# EAGLE design analog3 (EAGLE 6.5.0)
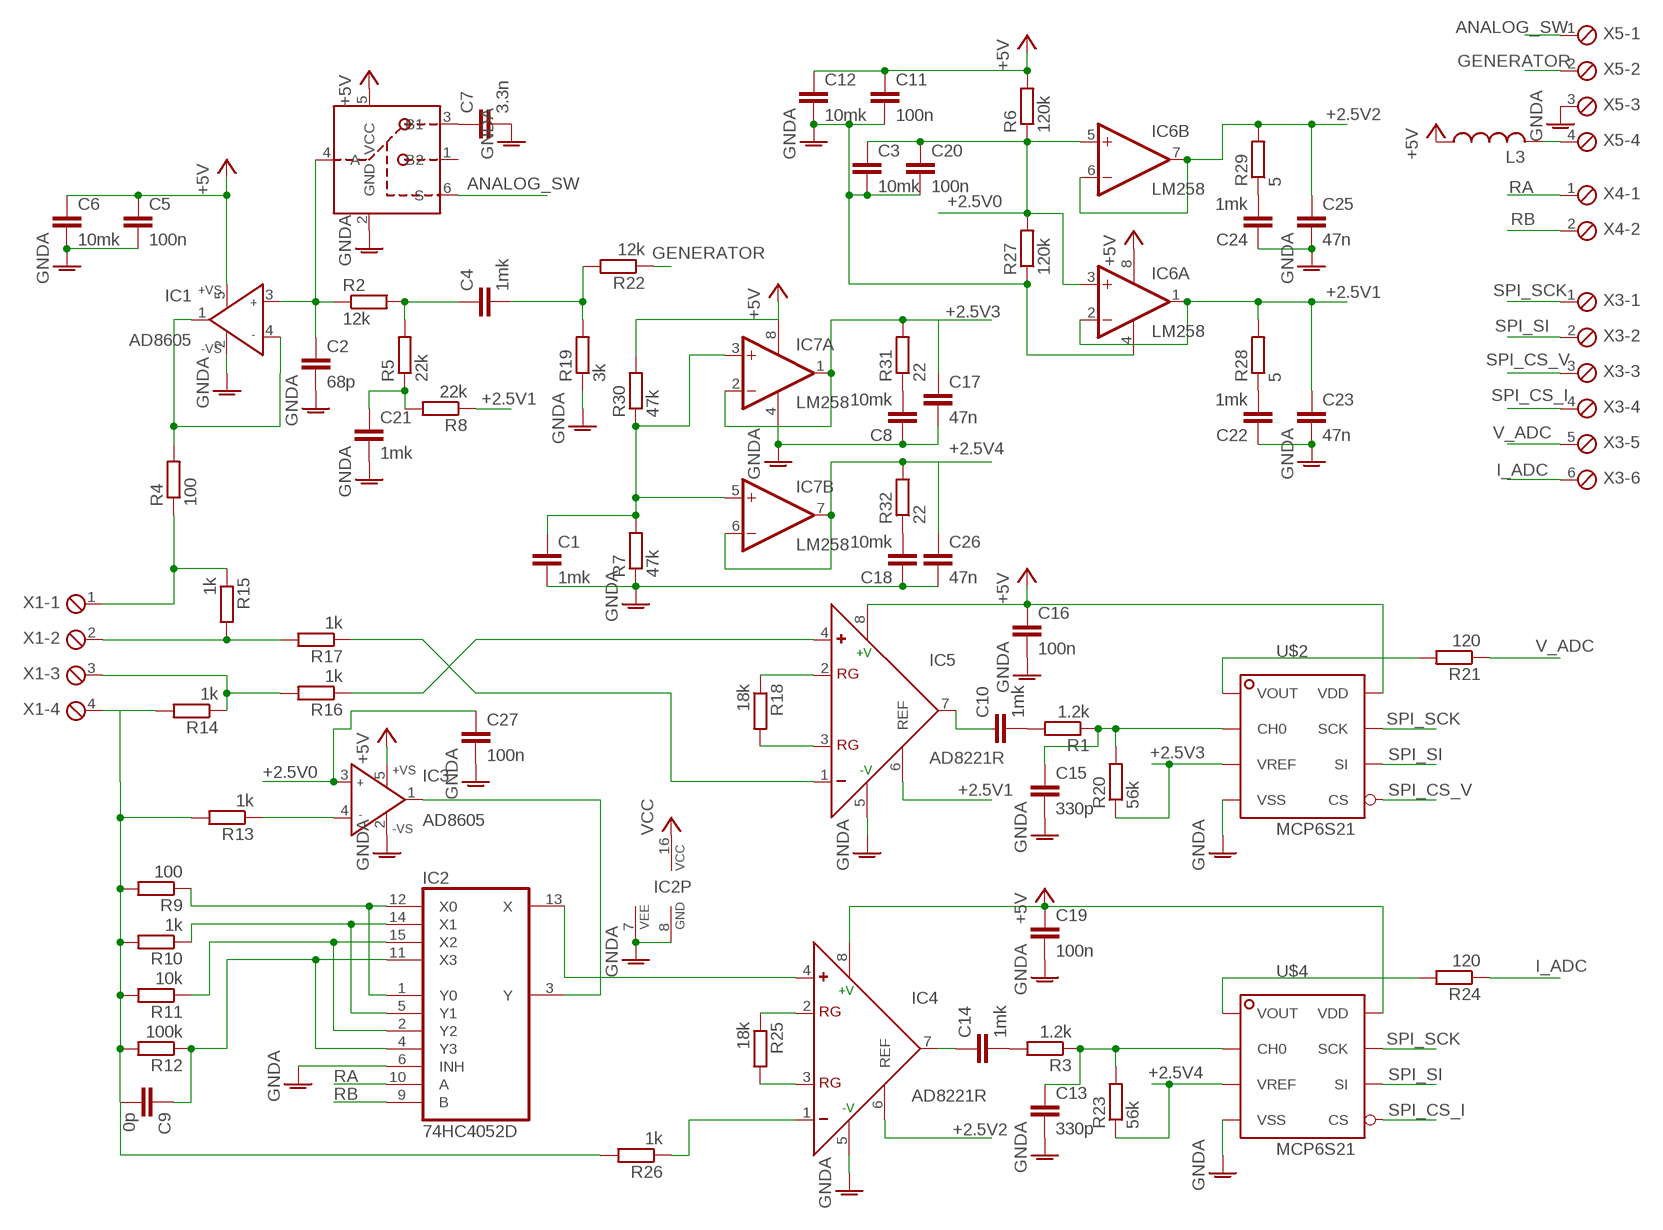
[diagram p0: schematic, sheet 1]

## Parts
C1  1mk  C-EUC0603  [C0603]
C2  68p  C-EUC0805  [C0805]
C3  10mk  C-EUC0805  [C0805]
C4  1mk  C-EUC0603  [C0603]
C5  100n  C-EUC0603  [C0603]
C6  10mk  C-EUC0805  [C0805]
C7  3.3n  C-EUC0805  [C0805]
C8  10mk  C-EUC0805  [C0805]
C9  0p  C-EUC0805  [C0805]
C10  1mk  C-EUC0603  [C0603]
C11  100n  C-EUC0603  [C0603]
C12  10mk  C-EUC0805  [C0805]
C13  330p  C-EUC0805  [C0805]
C14  1mk  C-EUC0603  [C0603]
C15  330p  C-EUC0805  [C0805]
C16  100n  C-EUC0603  [C0603]
C17  47n  C-EUC0805  [C0805]
C18  10mk  C-EUC0805  [C0805]
C19  100n  C-EUC0603  [C0603]
C20  100n  C-EUC0603  [C0603]
C21  1mk  C-EUC0603  [C0603]
C22  1mk  C-EUC0603  [C0603]
C23  47n  C-EUC0805  [C0805]
C24  1mk  C-EUC0603  [C0603]
C25  47n  C-EUC0805  [C0805]
C26  47n  C-EUC0805  [C0805]
C27  100n  C-EUC0603  [C0603]
IC1  AD8605  AD8603UJ  [SOT23-5]
IC2  74HC4052D  4052D  [SO16]
IC3  AD8605  AD8603UJ  [SOT23-5]
IC4  AD8221R  [SO8]
IC5  AD8221R  [SO8]
IC6  LM258  LM358D  [SO08]
IC7  LM258  LM358D  [SO08]
L3  L-US0204/7  [0204/7]
R1  1.2k  R-EU_R0603  [R0603]
R2  12k  R-EU_R0603  [R0603]
R3  1.2k  R-EU_R0603  [R0603]
R4  100  R-EU_R0603  [R0603]
R5  22k  R-EU_R0603  [R0603]
R6  120k  R-EU_R0603  [R0603]
R7  47k  R-EU_R0603  [R0603]
R8  22k  R-EU_R0603  [R0603]
R9  100  R-EU_R0603  [R0603]
R10  1k  R-EU_R0603  [R0603]
R11  10k  R-EU_R0603  [R0603]
R12  100k  R-EU_R0603  [R0603]
R13  1k  R-EU_R0603  [R0603]
R14  1k  R-EU_R0603  [R0603]
R15  1k  R-EU_R0603  [R0603]
R16  1k  R-EU_R0603  [R0603]
R17  1k  R-EU_R0603  [R0603]
R18  18k  R-EU_R0603  [R0603]
R19  3k  R-EU_R0603  [R0603]
R20  56k  R-EU_R0603  [R0603]
R21  120  R-EU_R0603  [R0603]
R22  12k  R-EU_R0603  [R0603]
R23  56k  R-EU_R0603  [R0603]
R24  120  R-EU_R0603  [R0603]
R25  18k  R-EU_R0603  [R0603]
R26  1k  R-EU_R0603  [R0603]
R27  120k  R-EU_R0603  [R0603]
R28  5  R-EU_R0805  [R0805]
R29  5  R-EU_R0805  [R0805]
R30  47k  R-EU_R0603  [R0603]
R31  22  R-EU_R0805  [R0805]
R32  22  R-EU_R0805  [R0805]
U$1  SN74LVC1G3157DBVR  [SOT23-6]
U$2  MCP6S21  [SO8]
U$4  MCP6S21  [SO8]
X1  MPT4  [4POL254]
X3  MPT6  [6POL254]
X4  MPT2  [2POL254]
X5  MPT4  [4POL254]

## Nets
+2.5V0: C3.1 C20.1 C27.1 IC3.3(IN+) IC6.3(A:+IN) IC6.5(B:+IN) R6.1 R27.2
+2.5V1: C23.1 IC5.6(REF) IC6.1(A:OUT) IC6.2(A:-IN) R8.1 R28.2
+2.5V2: C25.1 IC4.6(REF) IC6.6(B:-IN) IC6.7(B:OUT) R29.2
+2.5V3: C17.1 IC7.1(A:OUT) IC7.2(A:-IN) R20.1 R31.2 U$2.3(VREF)
+2.5V4: C26.1 IC7.6(B:-IN) IC7.7(B:OUT) R23.1 R32.2 U$4.3(VREF)
+5V: C5.1 C6.1 C11.1 C12.1 C16.1 C19.1 IC1.5(+VS) IC3.5(+VS) IC4.8(+V) IC5.8(+V) IC6.8(P:V+) IC7.8(P:V+) L3.1 R6.2 R30.2 U$1.5(VCC) U$2.8(VDD) U$4.8(VDD)
ANALOG_SW: U$1.6(S) X5.1
GENERATOR: R22.1 X5.2
GNDA: C1.2 C2.2 C3.2 C5.2 C6.2 C7.2 C8.1 C11.2 C12.2 C13.2 C15.2 C16.2 C17.2 C18.1 C19.2 C20.2 C21.2 C22.1 C23.2 C24.1 C25.2 C26.2 C27.2 IC1.2(-VS) IC2.6(INH) IC2.7(VEE) IC2.8(GND) IC3.2(-VS) IC4.5(-V) IC5.5(-V) IC6.4(P:V-) IC7.4(P:V-) R7.1 R19.1 R27.1 U$1.2(GND) U$2.4(VSS) U$4.4(VSS) X5.3
I_ADC: R24.1 X3.6
N$1: IC5.1(-) R17.1
N$3: C2.1 IC1.3(IN+) R2.1 U$1.4(A)
N$4: C4.1 R2.2 R5.2
N$5: IC1.1(OUT) IC1.4(IN-) R4.2
N$6: L3.2 X5.4
N$7: C7.1 U$1.3(B1)
N$8: IC3.4(IN-) R13.1
N$9: IC4.3(RG) R25.2
N$10: C21.1 R5.1 R8.2
N$11: IC2.3(Y) IC3.1(OUT)
N$12: IC2.1(Y0) IC2.12(X0) R9.1
N$13: IC2.5(Y1) IC2.14(X1) R10.1
N$14: IC2.2(Y2) IC2.15(X2) R11.1
N$15: C9.1 IC2.4(Y3) IC2.11(X3) R12.1
N$16: R14.1 R16.2 X1.3
N$17: R15.2 R17.2 X1.2
N$18: C9.2 R9.2 R10.2 R11.2 R12.2 R13.2 R14.2 R26.2 X1.4
N$19: R4.1 R15.1 X1.1
N$20: C10.1 IC5.7(OUT)
N$21: IC4.2(RG) R25.1
N$22: IC4.1(-) R26.1
N$23: IC5.3(RG) R18.2
N$24: IC5.2(RG) R18.1
N$25: C13.1 R3.1 R23.2 U$4.2(CH0)
N$26: R24.2 U$4.1(VOUT)
N$27: C15.1 R1.1 R20.2 U$2.2(CH0)
N$28: R21.2 U$2.1(VOUT)
N$29: C14.1 IC4.7(OUT)
N$30: IC2.13(X) IC4.4(+)
N$31: C24.2 R29.1
N$32: IC5.4(+) R16.1
N$33: C8.2 R31.1
N$34: C4.2 R19.2 R22.2
N$35: C18.2 R32.1
N$36: C22.2 R28.1
N$37: C10.2 R1.2
N$38: C14.2 R3.2
N$41: C1.1 IC7.3(A:+IN) IC7.5(B:+IN) R7.2 R30.1
RA: IC2.10(A) X4.1
RB: IC2.9(B) X4.2
SPI_CS_I: U$4.5(CS) X3.4
SPI_CS_V: U$2.5(CS) X3.3
SPI_SCK: U$2.7(SCK) U$4.7(SCK) X3.1
SPI_SI: U$2.6(SI) U$4.6(SI) X3.2
V_ADC: R21.1 X3.5
VCC: IC2.16(VCC)
Unconnected: U$1.1(B2)

## Library data of the parts
C1-C27 = rcl:C-EU: CAPACITOR, European symbol
IC1 IC3 = analog-devices:AD8603: Precision Micropower, Low Noise CMOS, Rail-to-Rail Input/Output Operational Amplifiers Source: http://www.analog.com/static/imported-files/data_sheets/AD8603_8607_8609.pdf; MF: ALTERA CORPORATION; MPN: AD8603AUJZ-REEL7; OC_FARNELL: 1651290; OC_NEWARK: 59K6904
IC2 = 40xx:4052: Dual 4-channel ANALOG MULTIPLEXER
IC4 IC5 = balmer:AD8221: Low Cost, Low Power, Instrumentation Amplifier Source: http://www.analog.com/UploadedFiles/Data_Sheets/37793330023930AD620_e.pdf; MPN: AD620AR; OC_FARNELL: 1464424; OC_NEWARK: 05F7109
IC6 IC7 = linear:LM358: OP AMP also LM158; LM258; LM2904 Source: http://cache.national.com/ds/LM/LM158.pdf
L3 = rcl:L-US: INDUCTOR, American symbol
R1-R32 = rcl:R-EU_: RESISTOR, European symbol
U$1 = balmer:SN74LVC1G3157DBVR: SINGLE-POLE DOUBLE-THROW ANALOG SWITCH
U$2 U$4 = balmer:MCP6S21: Single-Ended, Rail-to-Rail I/O, Low Gain PGA
X1 X5 = con-phoenix-254:MPT4: PHOENIX CONNECTOR; OC_FARNELL: unknown; OC_NEWARK: unknown
X3 = con-phoenix-254:MPT6: PHOENIX CONNECTOR; OC_FARNELL: unknown; OC_NEWARK: unknown
X4 = con-phoenix-254:MPT2: PHOENIX CONNECTOR; OC_FARNELL: unknown; OC_NEWARK: unknown

## Board
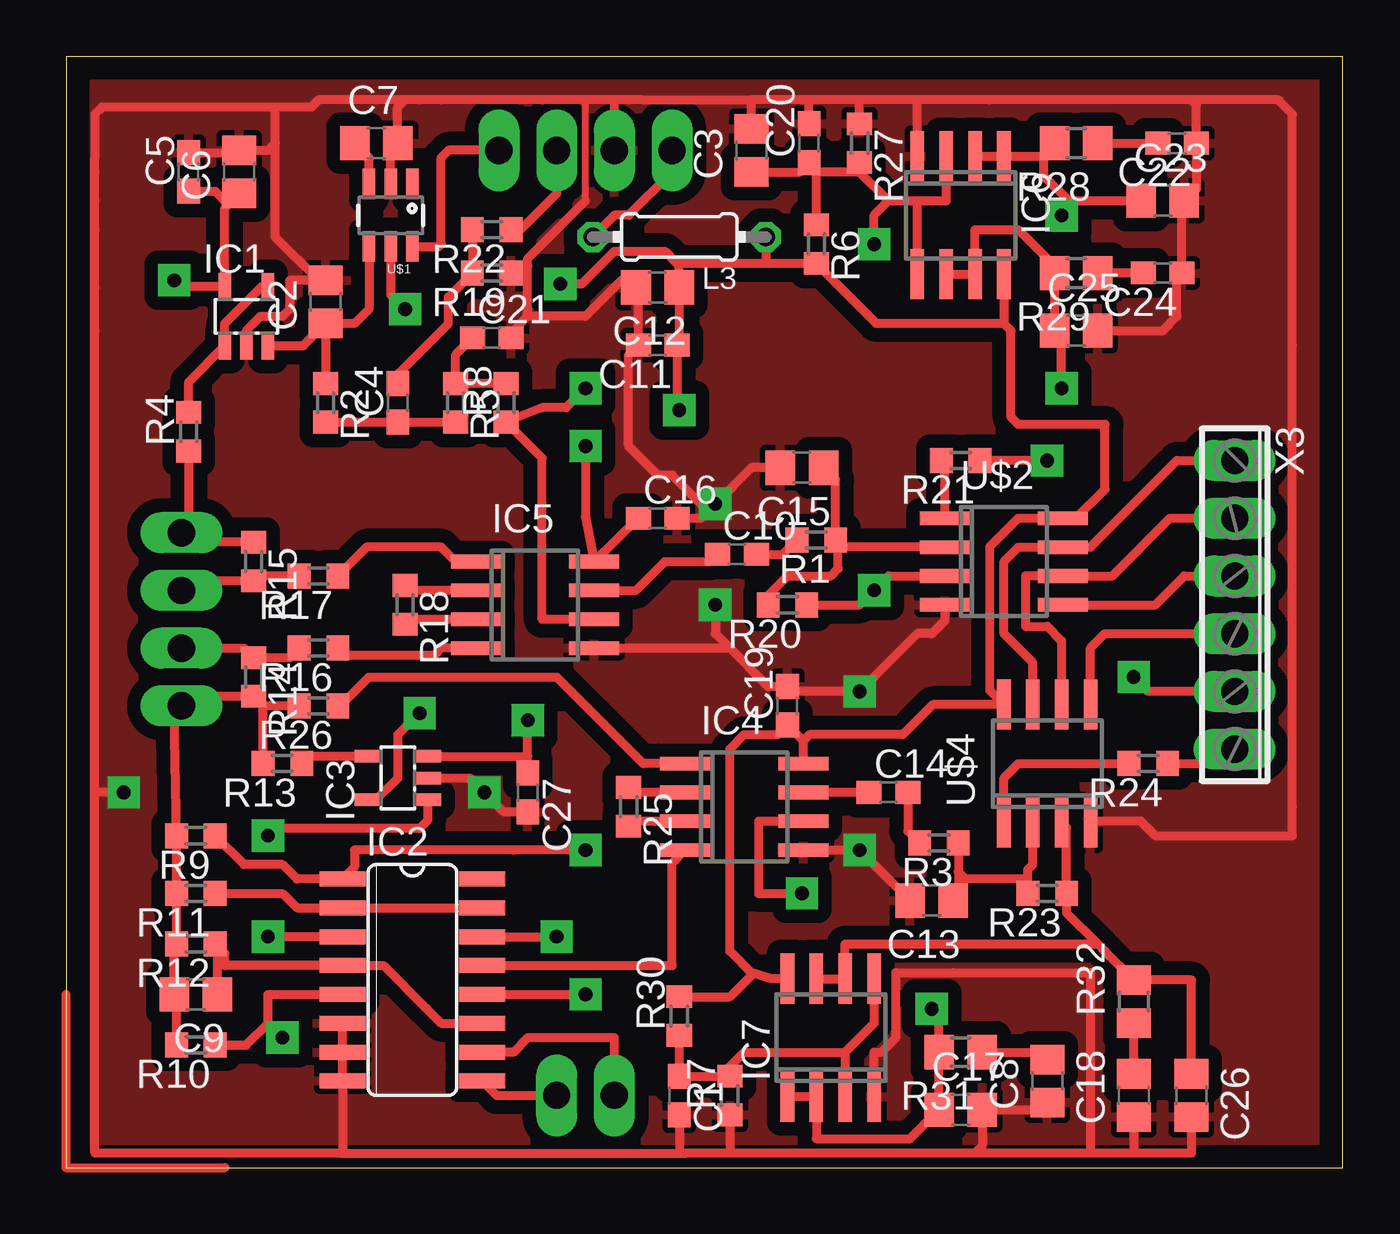
[diagram p1: board, top side]
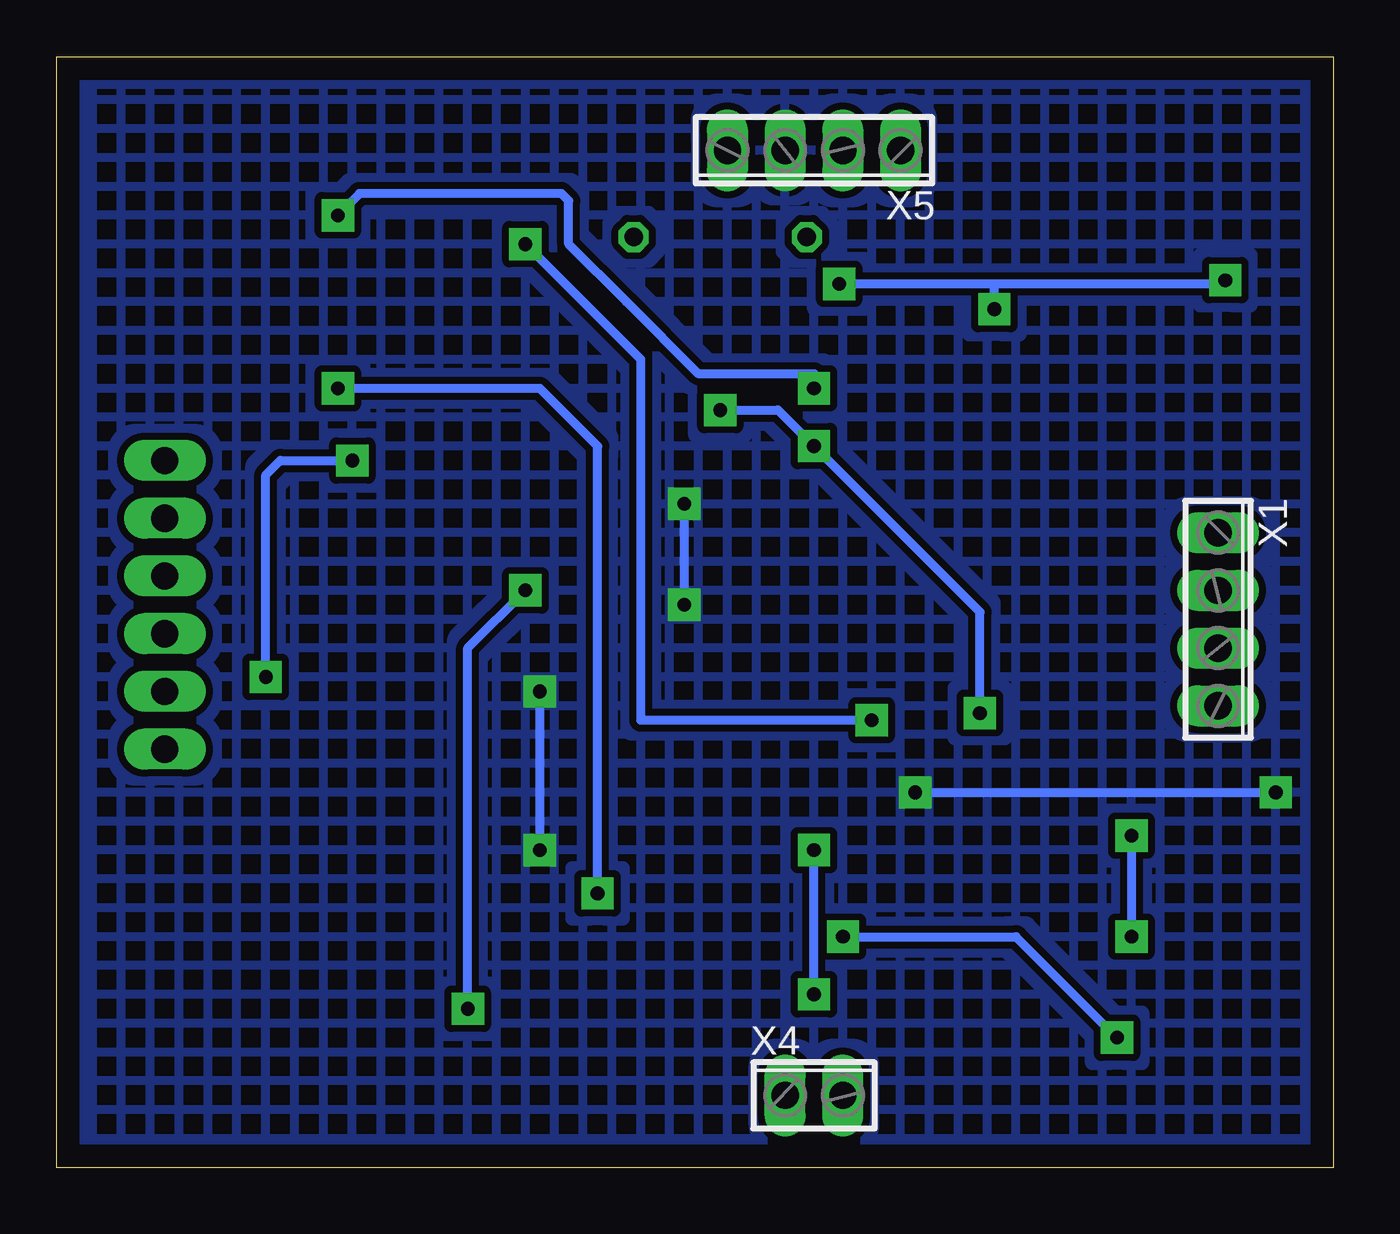
[diagram p2: board, bottom side, seen from below]

Size 56.19 x 48.88 mm. Coordinates in mm from the lower left corner, seen from the top.
Outline: 0,0 56.19,0 56.19,48.88 0,48.88 0,0
Copper layers (1*16): Top 0.035mm / dielectric 1.5mm / Bottom 0.035mm
Design rules "default": minimum track width 10mil, minimum drill 24mil, track to track 8mil, track to pad 8mil, pad to pad 8mil, via to via 8mil, smd to smd 8mil, copper to edge 40mil, drill to drill 8mil, minimum pad ring 10mil, minimum via ring 8mil, stop-mask expansion 4mil, vias tented up to drill 0mil, thermal gap 10mil

### Footprints (pad centres in the part's own frame; a part is rotated, then mirrored left to right if it is on the bottom)
C0603 = smd 1.1 x 1: 1 -0.85,0; 2 0.85,0
C0805 = smd 1.3 x 1.5: 1 -0.95,0; 2 0.95,0
SOT23-5 = smd 0.55 x 1.2: 1 -0.95,-1.3; 2 0,-1.3; 3 0.95,-1.3; 4 0.95,1.3; 5 -0.95,1.3
SO16 = smd 0.66 x 2.032: 1 -4.445,-3.073; 2 -3.175,-3.073; 3 -1.905,-3.073; 4 -0.635,-3.073; 5 0.635,-3.073; 6 1.905,-3.073; 7 3.175,-3.073; 8 4.445,-3.073; 9 4.445,3.073; 10 3.175,3.073; 11 1.905,3.073; 12 0.635,3.073; 13 -0.635,3.073; 14 -1.905,3.073; 15 -3.175,3.073; 16 -4.445,3.073
SO8 = smd 0.6 x 2.2: 1 -1.905,-2.6; 2 -0.635,-2.6; 3 0.635,-2.6; 4 1.905,-2.6; 5 1.905,2.6; 6 0.635,2.6; 7 -0.635,2.6; 8 -1.905,2.6
SO08 = smd 0.6 x 2.2: 1 -1.905,-2.6; 2 -0.635,-2.6; 3 0.635,-2.6; 4 1.905,-2.6; 5 1.905,2.6; 6 0.635,2.6; 7 -0.635,2.6; 8 -1.905,2.6
0204/7 = drill 0.813 octagon: 1 -3.81,0; 2 3.81,0
R0603 = smd 1 x 1.1: 1 -0.85,0; 2 0.85,0
R0805 = smd 1.3 x 1.5: 1 -0.95,0; 2 0.95,0
SOT23-6 = smd 0.55 x 1.35: 1 -0.95,-1.375; 2 0,-1.375; 3 0.95,-1.375; 4 0.95,1.375; 5 0,1.375; 6 -0.95,1.375
4POL254 = drill 1.2 long: 1 -3.81,0; 2 -1.27,0; 3 1.27,0; 4 3.81,0
6POL254 = drill 1.2 pad 1.778 long: 1 -6.35,0; 2 -3.81,0; 3 -1.27,0; 4 1.27,0; 5 3.81,0; 6 6.35,0
2POL254 = drill 1.2 long: 1 -1.27,0; 2 1.27,0

### Placement (x,y rotation side)
C1  26.99,3.17 270 top
C2  11.43,38.1 90 top
C3  30.16,44.77 90 top
C4  14.61,33.66 90 top
C5  5.4,43.81 90 top
C6  7.62,43.81 90 top
C7  13.65,45.09 0 top
C8  43.18,3.81 90 top
C9  5.71,7.62 180 top
C10  29.53,26.99 0 top
C11  26.04,36.2 180 top
C12  26.04,38.73 180 top
C13  38.1,11.75 180 top
C14  36.2,16.51 0 top
C15  32.38,30.8 180 top
C16  26.04,28.57 0 top
C17  39.37,2.54 0 top
C18  46.99,3.17 90 top
C19  31.75,20.32 90 top
C20  32.7,45.09 90 top
C21  18.73,36.51 0 top
C22  48.9,45.09 180 top
C23  48.26,42.55 0 top
C24  48.26,39.37 180 top
C25  44.45,36.83 0 top
C26  49.53,3.17 270 top
C27  20.32,16.51 270 top
IC1  7.94,37.47 0 top
IC2  15.24,8.26 270 top
IC3  14.61,17.14 90 top
IC4  29.84,15.88 270 top
IC5  20.64,24.77 270 top
IC6  39.37,41.91 180 top
IC7  33.66,5.71 0 top
L3  26.99,40.96 180 top
R1  33.02,27.62 180 top
R2  11.43,33.66 270 top
R3  38.42,14.29 180 top
R4  5.4,32.38 90 top
R5  17.14,33.66 270 top
R6  33.02,40.64 270 top
R7  29.21,3.17 90 top
R8  19.37,33.66 90 top
R9  5.71,14.61 180 top
R10  5.71,5.4 180 top
R11  5.71,12.06 180 top
R12  5.71,9.84 180 top
R13  9.53,17.78 180 top
R14  8.26,21.59 270 top
R15  8.26,26.67 270 top
R16  11.11,22.86 180 top
R17  11.11,26.04 180 top
R18  14.92,24.77 270 top
R19  18.73,39.37 180 top
R20  31.75,24.77 180 top
R21  39.37,31.11 180 top
R22  18.73,41.27 180 top
R23  43.18,12.06 180 top
R24  47.62,17.78 180 top
R25  24.77,15.88 270 top
R26  11.11,20.32 180 top
R27  34.92,45.09 270 top
R28  44.45,45.09 180 top
R29  44.45,39.37 180 top
R30  26.99,6.67 90 top
R31  39.37,5.08 180 top
R32  46.99,7.3 90 top
U$1  14.29,41.91 180 top
U$2  41.27,26.67 270 top
U$4  43.18,17.78 0 top
X1  5.08,24.13 270 bottom
X3  51.44,24.77 270 top
X4  22.86,3.17 0 bottom
X5  22.86,44.77 180 bottom

### Tracks (layer width: path | path; a pad name or v marks a point on that pad's centre or on a via)
+2.5V0  (via drill 0.6 pad 1.42)
  Top 0.406: R27.2 34.92,43.81 | 34.92,43.81 36.2,42.55 | 36.2,42.55 37.47,42.55 | 37.47,42.55 38.73,42.55 IC6.3 | IC6.5 37.47,42.55 | IC3.3 20.32,18.09 | v35.56,40.64 35.56,41.91 36.2,42.55 | C27.1 20.32,18.09 | 20.32,18.09 v20.32,19.68 | 34.92,43.81 33.12,43.81 | 33.12,43.81 C20.1 32.28,43.82 C3.1 | R6.1 33.02,43.71 33.12,43.81
  Bottom 0.406: v20.32,19.68 26.67,19.68 30.48,19.68 30.48,20.95 30.48,35.56 v35.56,40.64
+2.5V1  (via drill 0.6 pad 1.42)
  Top 0.406: IC6.2 IC6.1 42.92,44.51 43.02,44.61 | 43.02,44.61 R28.2 | v22.86,34.29 22.01,33.44 20.95,33.44 R8.1 20.95,31.22 20.95,24.13 IC5.6 | 43.02,44.61 43.02,43.66 44.13,42.55 | 44.13,42.55 C23.1 | 44.13,42.55 44.13,42.23 v43.81,41.91
  Bottom 0.406: v22.86,34.29 22.86,34.92 27.94,34.92 31.11,38.1 33.66,40.64 33.66,42.55 33.97,42.86 42.23,42.86 42.86,42.86 v43.81,41.91
+2.5V2  (via drill 0.6 pad 1.42)
  Top 0.406: IC6.6 IC6.7 40.01,41.27 41.91,41.27 43.18,40.01 43.18,39.69 R29.2 C25.1 43.81,36.52 v43.81,34.29 | IC4.6 30.48,15.24 30.48,12.06 v32.38,12.06
  Bottom 0.406: v32.38,12.06 32.38,31.75 34.92,34.29 v43.81,34.29
+2.5V3  (via drill 0.6 pad 1.42)
  Top 0.406: IC7.1 IC7.2 33.02,1.27 37.15,1.27 C17.1 R31.2 38.42,6.67 v38.1,6.99 | U$2.3 36.2,26.04 v35.56,25.4 34.92,24.77 R20.1
  Bottom 0.406: v38.1,6.99 38.1,22.86 v35.56,25.4
+2.5V4
  Top 0.406: U$4.3 44.03,14.96 R23.1 44.03,11.21 45.4,9.84 | IC7.7 IC7.6 34.29,9.84 45.4,9.84 | C26.1 49.53,8.26 R32.2 45.72,9.52 | 45.4,9.84 45.72,9.52 | 45.72,9.53 45.72,9.52
+5V  (via drill 0.6 pad 1.42)
  Top 0.406: C16.1 IC5.8 22.86,28.64 v22.86,31.75 | IC4.8 32.45,18.77 | 32.45,18.77 C19.1 31.33,19.05 29.84,19.05 29.21,18.41 29.21,17.78 29.21,9.53 30.16,8.57 30.25,8.55 | 41.91,28.57 40.64,27.3 40.64,21.02 U$4.8 38.16,20.38 36.83,19.05 32.72,19.05 32.45,18.77 | IC7.8 31.05,8.31 30.25,8.55 | 26.83,39.85 26.98,39.69 C12.1 26.98,36.3 C11.1 26.89,33.44 v26.99,33.34 | 30.8,39.79 R6.2 35.66,37.15 41.27,37.15 | 30.8,39.79 29.53,39.79 26.89,39.79 26.83,39.85 | v21.75,38.89 22.7,38.89 24.13,40.32 26.35,40.32 26.83,39.85 | 41.91,28.57 U$2.8 | 41.91,28.57 44.45,28.57 45.72,29.84 45.72,32.7 41.91,32.7 41.59,33.02 41.59,36.83 41.27,37.15 | IC6.8 41.27,37.15 | IC3.5 13.65,16.2 14.61,17.14 14.61,19.05 v15.56,20 | 7.14,42.39 6.99,42.23 IC1.5 5.05,38.77 v4.76,39.05 | 7.14,42.39 C6.1 | C5.1 6.57,42.97 7.14,42.39 | L3.1 30.8,39.79 | U$1.5 14.29,38.42 v14.92,37.78 | R30.2 29.22,7.52 30.25,8.55
  Bottom 0.406: v21.75,38.89 14.92,38.89 | 14.92,38.89 6.19,38.89 4.92,38.89 v4.76,39.05 | v15.56,20 15.56,24.45 v22.86,31.75 24.45,33.34 v26.99,33.34 | v14.92,37.78 14.92,38.89
ANALOG_SW
  Top 0.406: U$1.6 16.41,40.53 16.51,40.64 16.51,44.45 16.83,44.77 X5.1
GENERATOR
  Top 0.406: R22.1 20,41.27 21.59,42.86 X5.2
GNDA  (via drill 0.6 pad 1.42)
  Top 0.305: 22.86,42.55 22.86,46.99
  Top 0.406: IC2.6 IC2.7 IC2.8 12.17,0.74 | 1.27,16.51 1.27,0.64 12.06,0.64 26.99,0.64 | 1.27,16.51 1.27,36.83 1.27,38.73 1.27,41.27 1.27,42.55 1.27,43.81 1.27,44.45 1.27,46.35 1.58,46.67 9.21,46.67 | 9.21,46.67 10.79,46.67 11.12,46.99 13.65,46.99 14.92,46.99 | 24.13,46.99 24.77,46.99 25.4,46.99 30.16,46.99 | 24.13,46.99 22.86,46.99 20.95,46.99 20,46.99 16.51,46.99 15.56,46.99 14.92,46.99 | C12.2 25.18,38.63 C11.2 24.77,35.77 24.77,31.75 26.04,30.48 26.67,30.48 27.94,29.21 v28.57,29.21 | 30.16,46.99 32.38,46.99 32.7,46.99 | 37.47,46.99 40.64,46.99 49.53,46.99 | 37.47,46.99 34.92,46.99 | 34.92,46.99 32.7,46.99 | 49.53,46.99 53.34,46.99 53.55,46.77 53.98,46.35 53.98,36.2 53.98,15.88 53.98,14.61 47.94,14.61 47.31,15.24 45.15,15.24 U$4.4 | IC3.2 17.78,17.14 v18.41,16.51 19.27,15.66 C27.2 | v2.54,16.51 1.27,16.51 | C16.2 27.94,28.57 v28.57,29.21 | IC4.5 v34.92,13.97 C13.2 | U$2.4 38.67,24.07 38.1,23.5 37.47,23.5 v34.92,20.95 31.96,20.95 C19.2 30.9,21.17 30.8,21.27 29.21,22.86 | 24.66,38.31 C12.2 | C12.2 25.09,39.05 24.45,39.05 22.86,37.47 20.32,37.47 | IC6.4 37.47,46.99 | R27.1 34.92,46.99 | 49.53,46.99 49.74,46.77 C22.1 49.74,43.08 C23.2 49.11,42.45 C24.1 48.9,39.16 48.9,37.47 48.26,36.83 C25.2 | C8.1 42.76,2.54 C17.2 40.32,0.95 40.01,0.64 | 40.01,0.64 29.21,0.64 | 29.21,0.64 27.3,0.64 26.99,0.64 | 46.99,0.64 45.09,0.64 | 45.09,0.64 40.01,0.64 | IC7.4 35.56,5.08 35.88,5.08 36.51,5.71 36.51,8.57 39.05,8.57 45.09,8.57 45.09,5.08 45.09,0.64 | C20.2 32.7,46.99 | IC1.2 7.94,36.83 8.57,37.47 9.53,37.47 9.84,37.78 9.84,39.05 9.85,39.05 C2.2 11.12,39.05 9.21,40.96 9.21,45.09 | 9.21,45.09 9.21,46.67
  Top 0.406: C3.2 30.16,46.99 | 20.32,37.47 20.32,37.78 20.32,39.69 | R7.1 29.21,0.64 | 9.21,45.09 8.89,44.77 C6.2 7.52,44.66 C5.2 | v28.57,24.77 28.57,23.5 29.21,22.86 | IC5.5 29.21,22.86 | 20.32,39.69 20.32,40.01 22.86,42.55 | R19.1 20,39.37 20.32,39.69 | C21.2 19.58,36.73 20.32,37.47 | 14.92,46.99 14.6,46.67 C7.2 14.29,44.77 U$1.2 | C1.2 26.99,0.64 | C18.1 46.99,0.64 | C26.2 49.53,0.64 46.99,0.64 | C15.2 30.16,30.8 v28.57,29.21 | X5.3 24.13,46.99
  Bottom 0.406: v18.41,16.51 v2.54,16.51 | v28.57,29.21 v28.57,24.77 | v34.92,13.97 v34.92,20.95
  pour Top (isolate 0.61): 0,0 56.52,0 56.52,48.9 0,48.9
  pour Bottom (isolate 0.305, hatched): 0,48.9 56.52,48.9 56.52,0 0,0
I_ADC
  Top 0.406: R24.1 50.8,17.78 X3.6
N$1
  Top 0.406: IC5.1 17.14,26.67 16.51,27.3 13.23,27.3 R17.1
N$2
  Top 0.406: 0,7.62 0,0 6.99,0
N$3
  Top 0.406: IC1.3 10.45,36.16 C2.1 | U$1.4 13.34,37.78 12.7,37.15 C2.1 | C2.1 R2.1
N$4
  Top 0.406: R2.2 C4.1 R5.2
N$5
  Top 0.406: IC1.4 8.6,38.77 7.3,37.47 6.99,37.15 IC1.1 5.4,34.58 R4.2
N$6
  Top 0.406: X5.4 26.67,43.81 24.77,41.91 24.13,41.91 L3.2
N$7
  Top 0.406: U$1.3 13.34,44.45 C7.1
N$8
  Top 0.406: IC3.4 10.69,18.09 R13.1
N$9
  Top 0.406: IC4.3 24.98,15.24 R25.2
N$10
  Top 0.406: R8.2 R5.1 17.14,35.77 C21.1
N$11  (via drill 0.6 pad 1.42)
  Top 0.406: IC2.3 v8.89,10.16 | IC3.1 15.9,15.27 15.56,14.92 9.21,14.92 v8.89,14.61
  Bottom 0.406: v8.89,14.61 v8.89,10.16
N$12  (via drill 0.6 pad 1.42)
  Top 0.406: IC2.12 v22.86,7.62 | v22.86,13.97 19.68,13.97 12.7,13.97 12.7,13.23 IC2.1 10.16,12.7 9.53,13.34 7.83,13.34 R9.1
  Bottom 0.406: v22.86,7.62 v22.86,13.97
N$13  (via drill 0.6 pad 1.42)
  Top 0.406: 8.89,6.35 8.89,7.62 IC2.5 | IC2.14 v21.59,10.16 | v9.53,5.71 8.89,6.35 | R10.1 7.94,5.4 8.89,6.35
  Bottom 0.406: v21.59,10.16 13.97,10.16 v9.53,5.71
N$14
  Top 0.406: R11.1 9.53,12.06 10.16,11.43 IC2.2 IC2.15
N$15
  Top 0.406: IC2.11 16.51,6.35 15.88,6.99 13.97,8.89 IC2.4 6.99,8.89 6.99,9.42 6.93,9.47 | 6.93,9.47 R12.1 | C9.1 6.67,9.21 6.93,9.47
N$16
  Top 0.406: X1.3 7.83,22.86 R14.1 9.84,22.44 R16.2
N$17
  Top 0.406: X1.2 5.5,25.82 R15.2 8.47,26.04 R17.2
N$18
  Top 0.406: R13.2 8.68,20.32 | 8.68,20.32 R14.2 5.5,20.74 X1.4 4.76,20 R9.2 R11.2 R12.2 4.76,9.74 C9.2 4.87,7.52 R10.2 | R26.2 8.68,20.32
N$19
  Top 0.406: R15.1 5.5,27.52 X1.1 5.4,28.26 R4.1
N$20
  Top 0.406: IC5.7 25.08,25.4 26.35,26.67 28.36,26.67 C10.1
N$21
  Top 0.406: IC4.2 24.98,16.51 R25.1
N$22
  Top 0.406: IC4.1 25.4,17.78 21.59,21.59 13.34,21.59 12.06,20.32 R26.1
N$23
  Top 0.406: IC5.3 15.14,24.13 R18.2
N$24
  Top 0.406: IC5.2 15.14,25.4 R18.1
N$25
  Top 0.406: R23.2 42.33,12.7 | 42.33,12.7 42.33,13.12 42.55,13.34 U$4.2 | R3.1 39.27,13.02 | 39.27,13.02 39.27,11.96 C13.1 | 42.33,12.7 39.59,12.7 39.27,13.02
N$26
  Top 0.406: U$4.1 41.27,17.14 41.91,17.78 R24.2
N$27
  Top 0.406: R20.2 30.9,25.18 31.75,26.04 33.66,26.04 33.97,26.35 33.97,27.52 R1.1 | U$2.2 34.19,27.3 R1.1 | R1.1 33.87,30.26 C15.1
N$28
  Top 0.406: U$2.1 38.67,30.86 R21.2
N$29
  Top 0.406: C14.1 IC4.7
N$30
  Top 0.406: IC2.13 26.67,8.89 26.67,13.39 IC4.4
N$31
  Top 0.406: C24.2 R29.1
N$32
  Top 0.406: IC5.4 16.51,22.86 16.19,22.54 12.28,22.54 R16.1
N$33
  Top 0.406: R31.1 42.76,5.08 C8.2
N$34
  Top 0.406: R22.2 R19.2 16.83,38.31 16.83,37.15 14.61,34.92 C4.2
N$35
  Top 0.406: C18.2 R32.1
N$36
  Top 0.406: R28.1 C22.2
N$37
  Top 0.406: C10.2 31.54,26.99 R1.2
N$38
  Top 0.406: C14.2 37.05,14.81 R3.2
N$41
  Top 0.406: 34.29,5.08 29.84,5.08 29.21,4.45 R7.2 C1.1 R30.1 | 34.29,5.08 IC7.3 | IC7.5 35.56,6.35 34.29,5.08
RA
  Top 0.406: X4.1 24.13,5.71 20.32,5.71 19.68,5.08 IC2.10
RB
  Top 0.406: IC2.9 18.95,3.17 X4.2
SPI_CS_I
  Top 0.406: U$4.5 45.09,22.86 45.72,23.5 X3.4
SPI_CS_V
  Top 0.406: U$2.5 47.94,24.77 49.21,26.04 X3.3
SPI_SCK
  Top 0.406: U$4.7 42.55,22.23 41.27,23.5 41.27,26.67 41.91,27.3 U$2.7 45.09,27.3 48.9,31.11 X3.1
SPI_SI
  Top 0.406: U$4.6 43.81,23.18 43.18,23.81 42.23,23.81 42.23,26.04 U$2.6 46.04,26.04 48.58,28.57 X3.2
V_ADC  (via drill 0.6 pad 1.42)
  Top 0.406: v43.18,31.11 R21.1 | 47.31,21.27 v46.99,21.59 47.62,20.95 X3.5
  Bottom 0.406: v46.99,21.59 46.99,30.48 46.35,31.11 v43.18,31.11